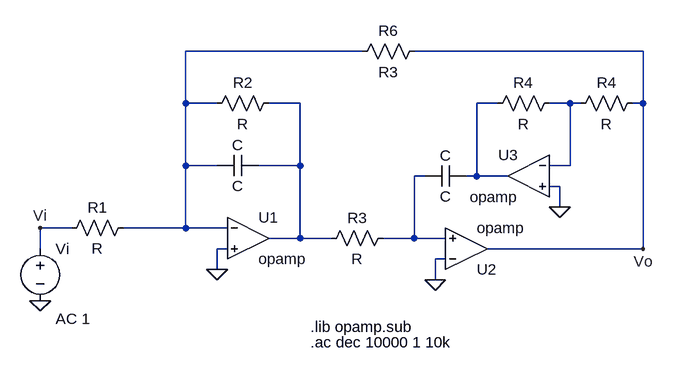
[diagram p0: schematic Simulacion LTspice.asc]
Simulacion LTspice.asc, the LTspice schematic file:
Version 4
SHEET 1 896 680
WIRE 432 -80 160 -80
WIRE 864 -80 512 -80
WIRE 160 0 160 -80
WIRE 208 0 160 0
WIRE 336 0 288 0
WIRE 640 0 608 0
WIRE 752 0 720 0
WIRE 768 0 752 0
WIRE 864 0 864 -80
WIRE 864 0 848 0
WIRE 160 96 160 0
WIRE 208 96 160 96
WIRE 336 96 336 0
WIRE 336 96 272 96
WIRE 752 96 752 0
WIRE 752 96 720 96
WIRE 528 112 512 112
WIRE 608 112 608 0
WIRE 608 112 592 112
WIRE 656 112 608 112
WIRE 736 128 720 128
WIRE 736 160 736 128
WIRE -16 192 -64 192
WIRE 160 192 160 96
WIRE 160 192 64 192
WIRE 224 192 160 192
WIRE 336 208 336 96
WIRE 336 208 288 208
WIRE 384 208 336 208
WIRE 512 208 512 112
WIRE 512 208 464 208
WIRE 560 208 512 208
WIRE -64 224 -64 192
WIRE 224 224 208 224
WIRE 864 224 864 0
WIRE 864 224 624 224
WIRE 560 240 544 240
WIRE 208 256 208 224
WIRE 544 272 544 240
FLAG 208 256 0
FLAG 544 272 0
FLAG 736 160 0
FLAG -64 192 Vi
FLAG 864 224 Vo
FLAG -64 304 0
SYMBOL res 80 176 R90
WINDOW 0 0 56 VBottom 2
WINDOW 3 32 56 VTop 2
SYMATTR InstName R1
SYMBOL res 304 -16 R90
WINDOW 0 0 56 VBottom 2
WINDOW 3 32 56 VTop 2
SYMATTR InstName R2
SYMBOL res 480 192 R90
WINDOW 0 0 56 VBottom 2
WINDOW 3 32 56 VTop 2
SYMATTR InstName R3
SYMBOL res 736 -16 R90
WINDOW 0 0 56 VBottom 2
WINDOW 3 32 56 VTop 2
SYMATTR InstName R4
SYMBOL res 864 -16 R90
WINDOW 0 0 56 VBottom 2
WINDOW 3 32 56 VTop 2
SYMATTR InstName R4
SYMBOL res 528 -96 R90
WINDOW 0 0 56 VBottom 2
WINDOW 3 32 56 VTop 2
SYMATTR InstName R6
SYMATTR Value R3
SYMBOL OpAmps\\opamp 256 144 R0
SYMATTR InstName U1
SYMBOL OpAmps\\opamp 592 288 M180
SYMATTR InstName U2
SYMBOL OpAmps\\opamp 688 48 M0
SYMATTR InstName U3
SYMBOL cap 592 96 R90
WINDOW 0 0 32 VBottom 2
WINDOW 3 32 32 VTop 2
SYMATTR InstName C
SYMBOL cap 272 80 R90
WINDOW 0 0 32 VBottom 2
WINDOW 3 32 32 VTop 2
SYMATTR InstName C
SYMBOL voltage -64 208 R0
WINDOW 123 24 124 Left 2
WINDOW 39 0 0 Left 0
SYMATTR InstName Vi
SYMATTR Value ""
SYMATTR Value2 AC 1
TEXT 352 344 Left 2 !.lib opamp.sub
TEXT 352 368 Left 2 !.ac dec 10000 1 10k

The netlist it stands for:
* Simulacion LTspice.asc
R1 N001 Vi R
R2 N002 N001 R
R3 N005 N002 R
R4 N004 N003 R
R4 Vo N004 R
R6 Vo N001 R3
XU1 N001 0 N002 opamp Aol=100K GBW=10Meg  ; pins invin noninvin out
XU2 0 N005 Vo opamp Aol=100K GBW=10Meg  ; pins invin noninvin out
XU3 N004 0 N003 opamp Aol=100K GBW=10Meg  ; pins invin noninvin out
C N003 N005 C
C N002 N001 C
Vi Vi 0 AC 1
.lib opamp.sub
.ac dec 10000 1 10k
.backanno
.end